# Altium schematic sheet Driver Board Port.SchDoc
size A4; SheetNumber: 6; SheetTotal: 6
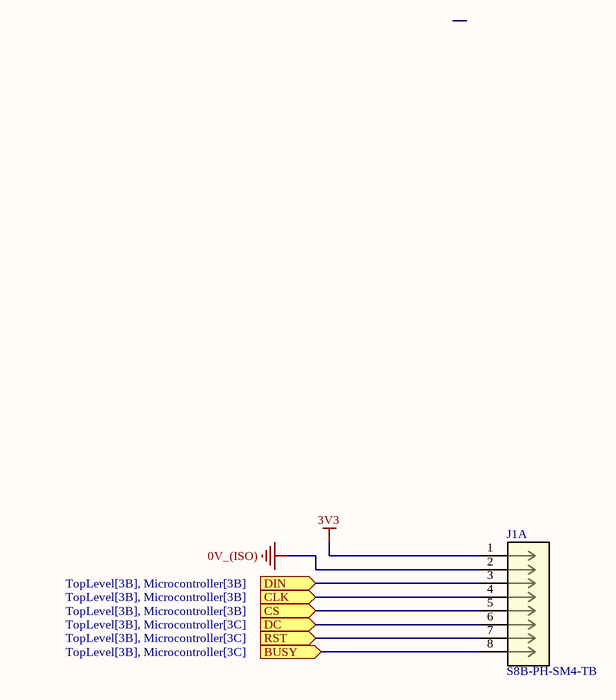
[diagram p0: Driver Board Port.SchDoc]

## Parts
J1  S8B-PH-SM4-TB  [CONN_S8B-PH-SM4-TB_JST]  (part A of 2)

## Ports
BUSY (in, see TopLevel[3B], Microcontroller[3C]), CLK (in, see TopLevel[3B], Microcontroller[3B]), CS (in, see TopLevel[3B], Microcontroller[3B]), DC (in, see TopLevel[3B], Microcontroller[3C]), DIN (in, see TopLevel[3B], Microcontroller[3B]), RST (in, see TopLevel[3B], Microcontroller[3C])

## Nets
0V_(ISO): J1.2
3V3: J1.1
BUSY: J1.8 ; port BUSY
CLK: J1.4 ; port CLK
CS: J1.5 ; port CS
DC: J1.6 ; port DC
DIN: J1.3 ; port DIN
RST: J1.7 ; port RST

## Library data of the parts
J1 = S8B-PH-SM4-TB: No Description Available; Mfr_Name: JST; RefDes: RefDes; Type: Type